# Altium project BLDR2_UnitBoard.PrjPcb
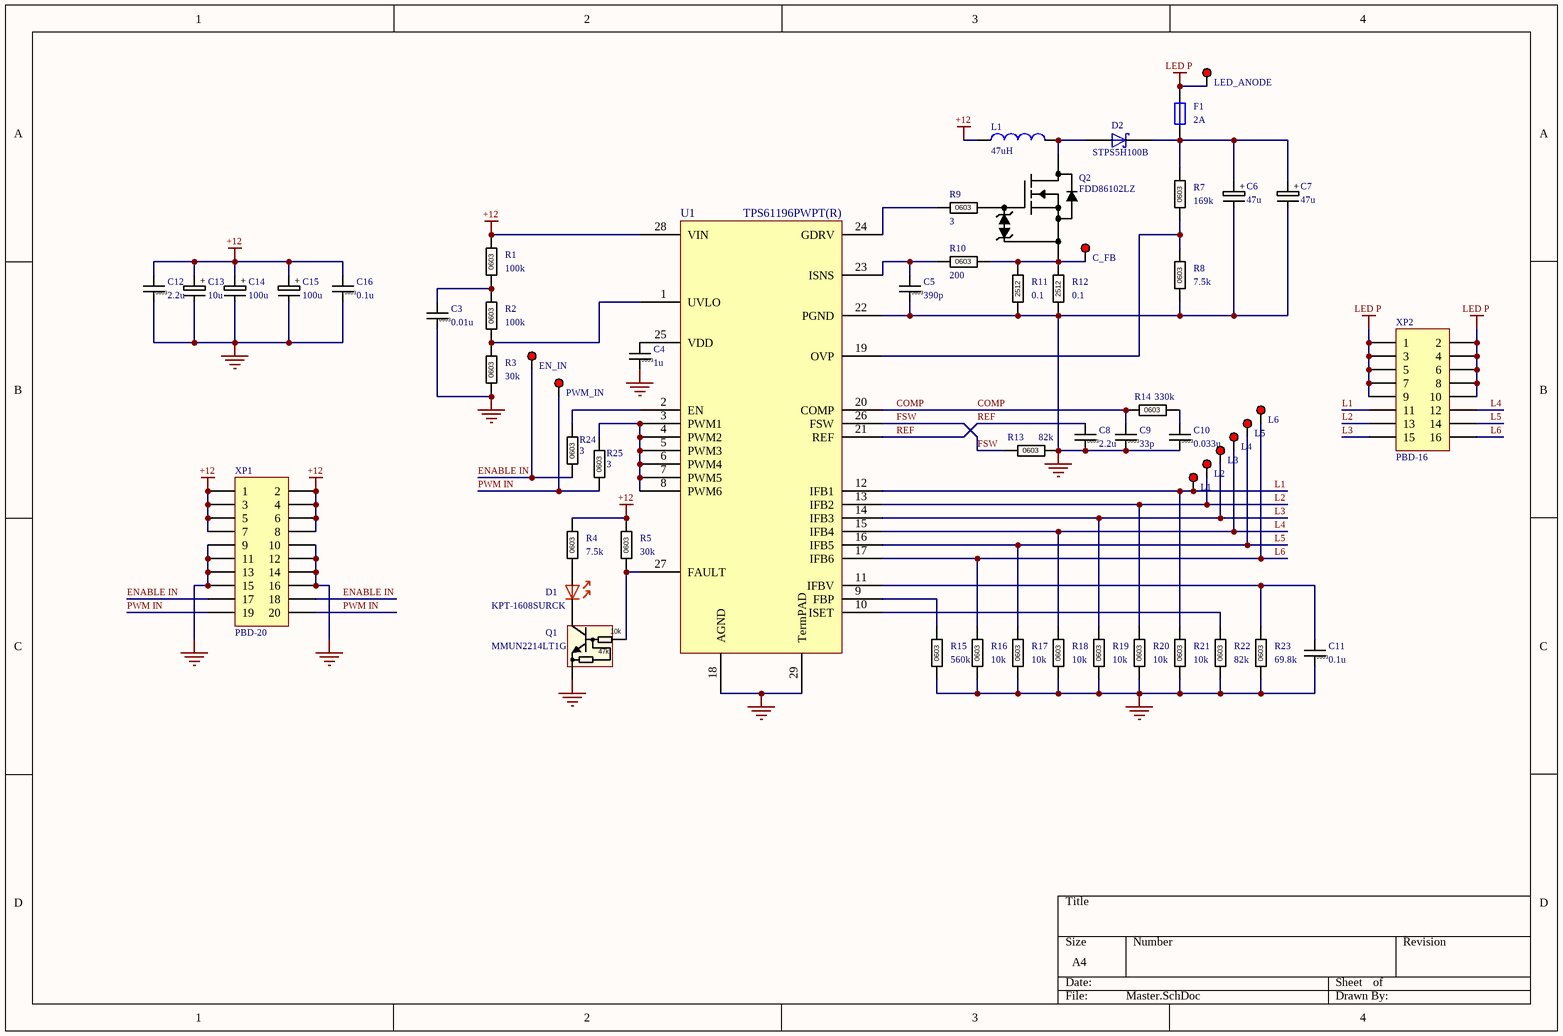
[diagram p0: Master.SchDoc]
1 sheet, 57 parts. Net scope: global (net labels, ports and power ports of the same name join across sheets).
Board file: Master.PcbDoc

## Sheet Master.SchDoc
size A4

### Parts
C3  Cap: 0.01u  Foot: 0603  [CAP_0603]  (hidden comment: 0603-X7R-50-0.01 мкф)
C4  Cap: 1u  Foot: 0603  [CAP_0603]  (hidden comment: 0603-X5R-10 1 мкф)
C5  Cap: 390p  Foot: 0603  [CAP_0603]  (hidden comment: 0603-NP0-50-390 пф J)
C6  Cap: 47u  [CAP_ECR 10X12.5]  (hidden comment: ECAP 47uF 100V 10x12.5)
C7  Cap: 47u  [CAP_ECR 10X12.5]  (hidden comment: ECAP 47uF 100V 10x12.5)
C8  Cap: 2.2u  Foot: 0603  [CAP_0603]  (hidden comment: 0603-X7R-10 2.2 мкф)
C9  Cap: 33p  Foot: 0603  [CAP_0603]  (hidden comment: 0603-NP0-50-33 пф J)
C10  Cap: 0.033u  Foot: 0603  [CAP_0603]  (hidden comment: 0603-X7R-50-0.033 мкф)
C11  Cap: 0.1u  Foot: 0603  [CAP_0603]  (hidden comment: 0603-X7R-50-0.1 мкф)
C12  Cap: 2.2u  Foot: 0603  [CAP_0603]  (hidden comment: 0603-X7R-10 2.2 мкф)
C13  Cap: 10u  [CAP_ECR 5X11]  (hidden comment: ESX 50 в-10 мкф 5x11 Hitano)
C14  Cap: 100u  [CAP_ECR 5X11]  (hidden comment: ECAP (К50-35), 100мкФ, 35В, 105°C, 20%, 6.3x12мм P:2.5мм)
C15  Cap: 100u  [CAP_ECR 5X11]  (hidden comment: ECAP (К50-35), 100мкФ, 35В, 105°C, 20%, 6.3x12мм P:2.5мм)
C16  Cap: 0.1u  Foot: 0603  [CAP_0603]  (hidden comment: 0603-X7R-50-0.1 мкф)
D1  value KPT-1608SURCK  [LED_0603_RED]  (hidden comment: KPT-1608SURCK, KingBright)
D2  STPS5H100B  [D-PAK]
F1  2A  [FUSE_LITTEL_0154]
L1  47uH  [INDUCTOR_B82477G]
Q1  MMUN2214LT1G  [SOT_23]
Q2  FDD86102LZ  [D-PAK]
R1  value 100k  Foot: 0603  [resistor_0603]  (hidden comment: 0603-100к J)
R2  value 100k  Foot: 0603  [resistor_0603]  (hidden comment: 0603-100к J)
R3  value 30k  Foot: 0603  [resistor_0603]  (hidden comment: 0603-30к F)
R4  value 7.5k  Foot: 0603  [resistor_0603]  (hidden comment: 0603-7.5 к F)
R5  value 30k  Foot: 0603  [resistor_0603]  (hidden comment: 0603-30к F)
R7  value 169k  Foot: 0603  [resistor_0603]  (hidden comment: 0603-169 к F)
R8  value 7.5k  Foot: 0603  [resistor_0603]  (hidden comment: 0603-7.5 к F)
R9  value 3  Foot: 0603  [resistor_0603]  (hidden comment: 0603-3 F)
R10  value 200  Foot: 0603  [resistor_0603]  (hidden comment: 0603-200 F)
R11  value 0.1  Foot: 2512  [resistor_2512]  (hidden comment: 2512-0.1 F)
R12  value 0.1  Foot: 2512  [resistor_2512]  (hidden comment: 2512-0.1 F)
R13  value 82k  Foot: 0603  [resistor_0603]  (hidden comment: 0603-82 к J)
R14  value 330k  Foot: 0603  [resistor_0603]  (hidden comment: 0603-330 J)
R15  value 560k  Foot: 0603  [resistor_0603]  (hidden comment: 0603-560 к F)
R16  value 10k  Foot: 0603  [resistor_0603]  (hidden comment: 0603-10к J)
R17  value 10k  Foot: 0603  [resistor_0603]  (hidden comment: 0603-10к J)
R18  value 10k  Foot: 0603  [resistor_0603]  (hidden comment: 0603-10к J)
R19  value 10k  Foot: 0603  [resistor_0603]  (hidden comment: 0603-10к J)
R20  value 10k  Foot: 0603  [resistor_0603]  (hidden comment: 0603-10к J)
R21  value 10k  Foot: 0603  [resistor_0603]  (hidden comment: 0603-10к J)
R22  value 82k  Foot: 0603  [resistor_0603]  (hidden comment: 0603-82 к J)
R23  value 69.8k  Foot: 0603  [resistor_0603]  (hidden comment: 0603-69.8 к F)
R24  value 3  Foot: 0603  [resistor_0603]  (hidden comment: 0603-3 F)
R25  value 3  Foot: 0603  [resistor_0603]  (hidden comment: 0603-3 F)
TP1  LED_ANODE  [OTHER_SMD_TP_1.5MM]
TP2  EN_IN  [OTHER_SMD_TP_1.5MM]
TP3  PWM_IN  [OTHER_SMD_TP_1.5MM]
TP4  L1  [OTHER_SMD_TP_1.5MM]
TP5  L2  [OTHER_SMD_TP_1.5MM]
TP6  L3  [OTHER_SMD_TP_1.5MM]
TP7  L4  [OTHER_SMD_TP_1.5MM]
TP8  L5  [OTHER_SMD_TP_1.5MM]
TP9  L6  [OTHER_SMD_TP_1.5MM]
TP10  C_FB  [OTHER_SMD_TP_1.5MM]
U1  TPS61196PWPT(R)  [HTSSOP_28]
XP1  PBD-20  [CONN_PBD-20]
XP2  PBD-16  [CONN_PBD-16]

### Nets
+12: C12.1 C13.1 C14.1 C15.1 C16.1 L1.1 R1.2 R4.2 R5.2 U1.28(VIN) XP1.1 XP1.2 XP1.3 XP1.4 XP1.5 XP1.6 XP1.7 XP1.8
GND: C3.2 C4.2 C5.2 C6.2 C7.2 C8.2 C9.2 C10.2 C11.2 C12.2 C13.2 C14.2 C15.2 C16.2 Q1.2(E) R3.1 R8.1 R11.1 R12.1 R13.2 R15.1 R16.1 R17.1 R18.1 R19.1 R20.1 R21.1 R22.1 R23.1 U1.18(AGND) U1.22(PGND) U1.29(TermPAD) XP1.9 XP1.10 XP1.11 XP1.12 XP1.13 XP1.14 XP1.15 XP1.16
LED P: F1.2 TP1.1 XP2.1 XP2.2 XP2.3 XP2.4 XP2.5 XP2.6 XP2.7 XP2.8 XP2.9 XP2.10
COMP: C9.1 R14.2 U1.20(COMP)
ENABLE IN: R24.1 TP2.1 XP1.17 XP1.18
FSW: R13.1 U1.26(FSW)
L1: R21.2 TP4.1 U1.12(IFB1) XP2.11
L2: R20.2 TP5.1 U1.13(IFB2) XP2.13
L3: R19.2 TP6.1 U1.14(IFB3) XP2.15
L4: R18.2 TP7.1 U1.15(IFB4) XP2.12
L5: R17.2 TP8.1 U1.16(IFB5) XP2.14
L6: R16.2 TP9.1 U1.17(IFB6) XP2.16
PWM IN: R25.1 TP3.1 XP1.19 XP1.20
REF: C8.1 U1.21(REF)
NetC3_1: C3.1 R1.1 R2.2
NetC4_1: C4.1 U1.25(VDD)
NetC5_1: C5.1 R10.1 U1.23(ISNS)
NetC6_1: C6.1 C7.1 D2.3(K) F1.1 R7.2
NetC10_1: C10.1 R14.1
NetC11_1: C11.1 R23.2 U1.11(IFBV)
NetD1_1: D1.1 R4.1
NetD1_2: D1.2 Q1.3(C)
NetD2_2: D2.2(A) L1.2 Q2.3(D)
NetQ1_1: Q1.1(B) R5.1 U1.27(FAULT)
NetQ2_1: Q2.1(G) R9.2
NetQ2_2: Q2.2(S) R10.2 R11.2 R12.2 TP10.1
NetR2_1: R2.1 R3.2 U1.1(UVLO)
NetR7_1: R7.1 R8.2 U1.19(OVP)
NetR9_1: R9.1 U1.24(GDRV)
NetR15_2: R15.2 U1.9(FBP)
NetR22_2: R22.2 U1.10(ISET)
NetR24_2: R24.2 U1.2(EN)
NetR25_2: R25.2 U1.3(PWM1) U1.4(PWM2) U1.5(PWM3) U1.6(PWM4) U1.7(PWM5) U1.8(PWM6)

### Notes on the sheet
- (in symbol BEC_MMUN2214LT1G_50V 0.1A 0.25W) 10k; 47k
- (in symbol ECAP 47uF 100V 10x12.5) +
- (in symbol ECAP 50V 100uF 6.3x12) +
- (in symbol ESX 50 в-10 мкф 5x11 Hitano) +

### Library data of the parts
C3 = 0603-X7R-50-0.01 мкф: Конденсатор Чип Керамический; Voltage: 50V
C4 = 0603-X5R-10 1 мкф: Конденсатор Чип Керамический; Voltage: 10V
C5 = 0603-NP0-50-390 пф J: Конденсатор Чип Керамический; Voltage: 50V
C6 C7 = ECAP 47uF 100V 10x12.5: Analog: EXR 16 в-3300 мкф 16x26; Voltage: 100V
C8 C12 = 0603-X7R-10 2.2 мкф: Конденсатор Чип Керамический; Voltage: 10V
C9 = 0603-NP0-50-33 пф J: Конденсатор Чип Керамический; Voltage: 50V
C10 = 0603-X7R-50-0.033 мкф: Конденсатор Чип Керамический; Voltage: 50V
C11 C16 = 0603-X7R-50-0.1 мкф: Конденсатор Чип Керамический; Voltage: 50V; Price, $: 0.1
C13 = ESX 50 в-10 мкф 5x11 Hitano: Конденсатор Алюминиевый Низкоимпедансный; Voltage: 50V; Analog: EXR 50 в-10 мкф 5x11 Hitano
C14 C15 = ECAP 50V 100uF 6.3x12: Конденсатор электролитический алюминиевый; Voltage: 50V
D1 = LED_0603_KPT-1608SURCK_red_120mcd: Analog: 150060RS75000; HelpURL: L:\Dev\Техническая документация\Светодиоды\Kingbright\SMD\KPT-1608SURCK(0603).pdf
D2 = Schottky_STPS5H100B: DIODE SCHOTTKY 5A 100V
F1 = FUSE_LITTEL 0154: Плавкий предохранитель LITTELFUSE 0154
L1 = INDUCTOR_B82477G4473M: 47 мкГн, 2.5 А, 12.8х12.8, Катушка индуктивности SMD
Q1 = BEC_MMUN2214LT1G_50V 0.1A 0.25W: NPN Digital Transistor; Published: 17-Sep-2003; DatasheetDocument: Jun-1999; PackageDocument: May-1999; PackageReference: SOT23; Publisher: Altium Limited
Q2 = MOSFET_FDD86102LZ: MOSFET N-CHANNEL 100V 8A; URL: https://www.chipdip.ru/product/fdd86102lz-mosfet-n-channel-100v-8a
R1 R2 = 0603-100 к J: Резистор Чип; Power: 0.1W; Price, $: 0.015
R3 R5 = 0603-30 к F: Резистор Чип; Power: 0.1W; Tolerance: 1%
R4 R8 = 0603-7.5 к F: Резистор Чип; Power: 0.1W; Tolerance: 1%
R7 = 0603-169 к F: Резистор Чип; Power: 0.1W; Tolerance: 1%
R9 R24 R25 = 0603-3 F: Резистор Чип; Power: 0.1W; Tolerance: 1%
R10 = 0603-200 F: Резистор Чип; Power: 0.1W; Tolerance: 1%
R11 R12 = 2512-0.1 F: Резистор Чип; Power: 1W
R13 R22 = 0603-82 к J: Резистор Чип; Power: 0.1W
R14 = 0603-330 J: Резистор Чип; Power: 0.1W; Price, $: 0.015
R15 = 0603-560 к F: Резистор Чип; Power: 0.1W; Tolerance: 1%
R16-R21 = 0603-10 к J: Резистор Чип; Power: 0.1W; Price, $: 0.015
R23 = 0603-69.8 к F: Резистор Чип; Power: 0.1W; Tolerance: 1%
TP1-TP10 = Test Point_1.5MM
U1 = LED DRV_TPS61196
XP1 = CONN_PBD-20: Header, 10-Pin, Dual row; LatestRevisionDate: 17-Jul-2002; LatestRevisionNote: Re-released for DXP Platform.; Publisher: Altium Limited
XP2 = CONN_PBD-16: Header, 8-Pin, Dual row; LatestRevisionDate: 17-Jul-2002; LatestRevisionNote: Re-released for DXP Platform.; Publisher: Altium Limited